# Altium project solar-powered-remote-water-level-relay.PrjPcb
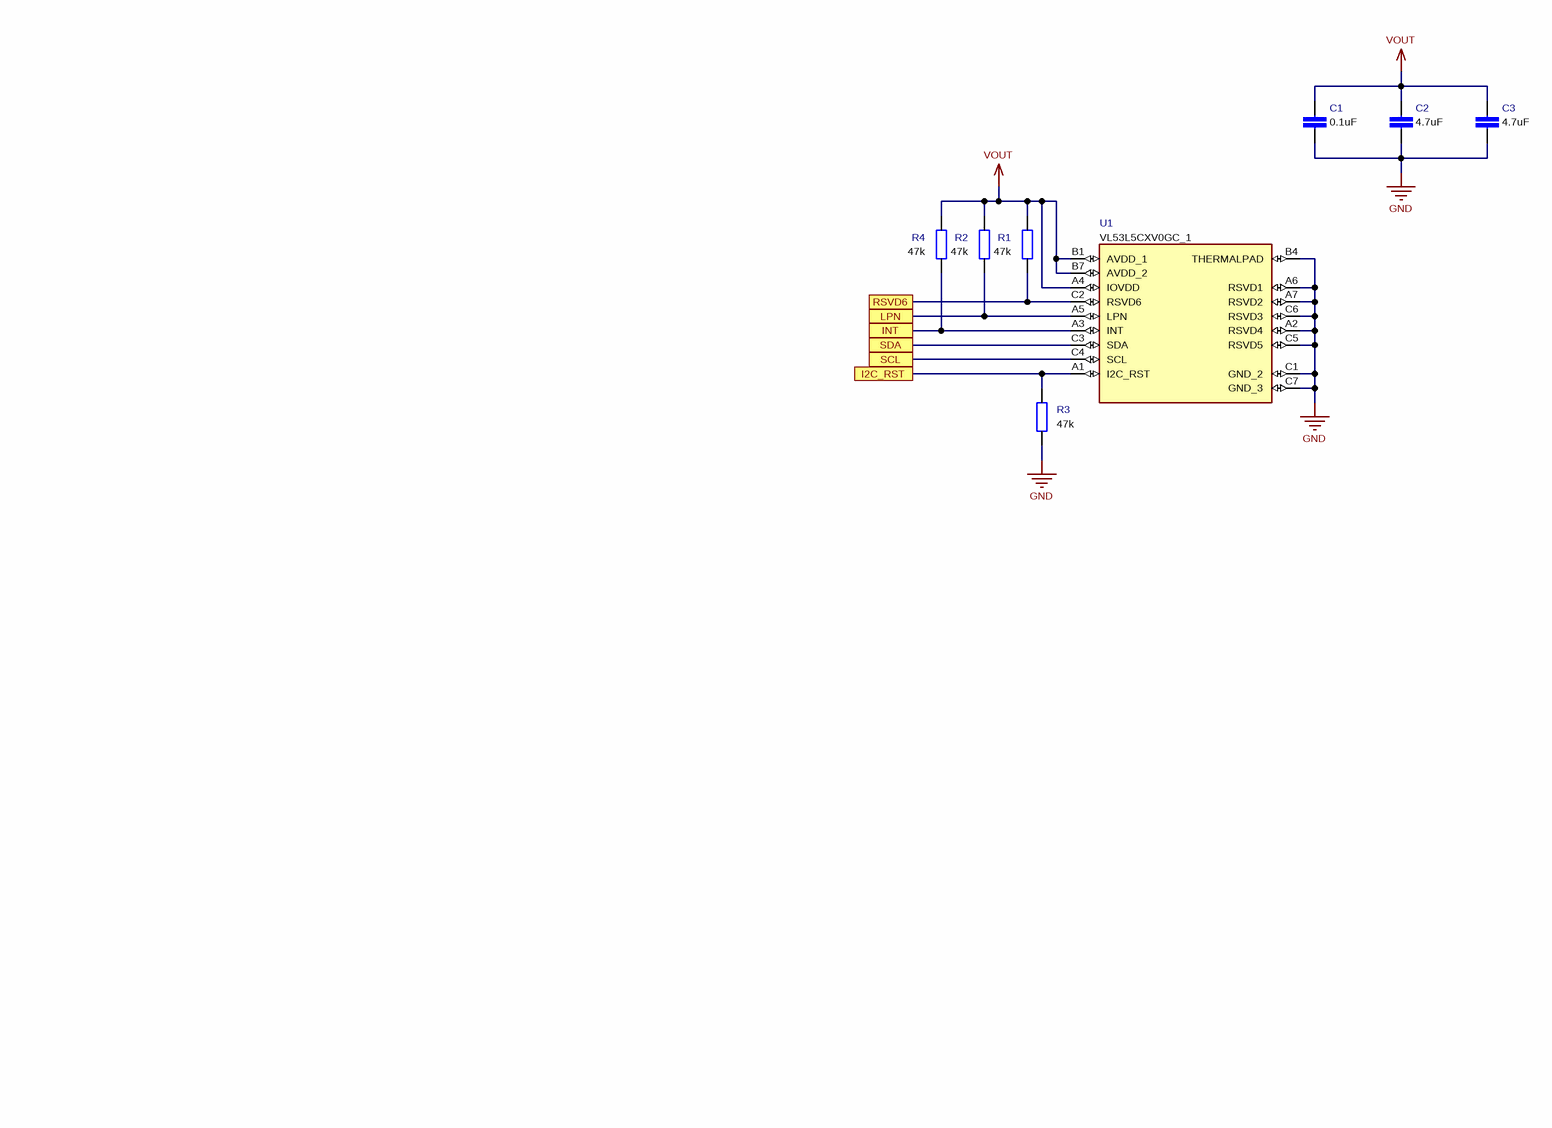
[diagram p0: Sheet1.SchDoc]
11 sheets, 50 parts. Net scope: global (net labels, ports and power ports of the same name join across sheets).
Board file: solar-powered-remote-water-level-relay.PcbDoc
Sheets:
  Sheet1.SchDoc
  Sheet2.SchDoc
  Sheet3.SchDoc
  Sheet4.SchDoc
  Sheet5.SchDoc
  Sheet6.SchDoc
  Sheet7.SchDoc
  Sheet8.SchDoc
  Sheet9.SchDoc
  Sheet10.SchDoc
  Sheet11.SchDoc

## Sheet Sheet1.SchDoc: solar-powered-remote-water-level-relay
size 419 x 297 mm; Date: 2026/06/29; Author: forlook88@gmail.com; Revision: 0; SheetNumber: 1; SheetTotal: 11

### Parts
C1  value 0.1uF
C2  value 4.7uF
C3  value 4.7uF
R1  value 47k
R2  value 47k
R3  value 47k
R4  value 47k
U1  value VL53L5CXV0GC_1

### Ports
I2C_RST, INT, LPN, RSVD6, SCL, SDA

### Nets
GND: C1.2 C2.2 C3.2 R3.1 U1.A2(RSVD4) U1.A6(RSVD1) U1.A7(RSVD2) U1.B4(THERMALPAD) U1.C1(GND_2) U1.C5(RSVD5) U1.C6(RSVD3) U1.C7(GND_3)
VOUT: C1.1 C2.1 C3.1 R1.1 R2.1 R4.1 U1.A4(IOVDD) U1.B1(AVDD_1) U1.B7(AVDD_2)
I2C_RST: R3.2 U1.A1(I2C_RST) ; port I2C_RST
INT: R4.2 U1.A3(INT) ; port INT
LPN: R2.2 U1.A5(LPN) ; port LPN
RSVD6: R1.2 U1.C2(RSVD6) ; port RSVD6
SCL: U1.C4(SCL) ; port SCL
SDA: U1.C3(SDA) ; port SDA

### Notes on the sheet
- Document Name:
- Project Name:
- Sheet Name:
- Sheet Number:
- Author:
- CELUS Design Platform electronic designs are machine-generated drafts and require verification by qualified specialists.
- of
- Revision:
- Date:
- By using these designs, you agree to the CELUS Terms of Use: https://www.celus.io/terms-of-use

### Library data of the parts
C1 = (no symbol name): Manufacturer Part Number: 0402ZD104KAT2A; Manufacturer: KYOCERA AVX
C2 C3 = (no symbol name): Manufacturer Part Number: GRM188R61E475KE11D; Manufacturer: Murata
R1-R4 = (no symbol name): Manufacturer Part Number: CRCW060347K0FKEA; Manufacturer: Vishay
U1 = (no symbol name): Manufacturer: STMicroelectronics; Manufacturer Part Number: VL53L5CXV0GC_1

## Sheet Sheet2.SchDoc: solar-powered-remote-water-level-relay
size 419 x 297 mm; Date: 2026/06/29; Author: forlook88@gmail.com; Revision: 0; SheetNumber: 2; SheetTotal: 11
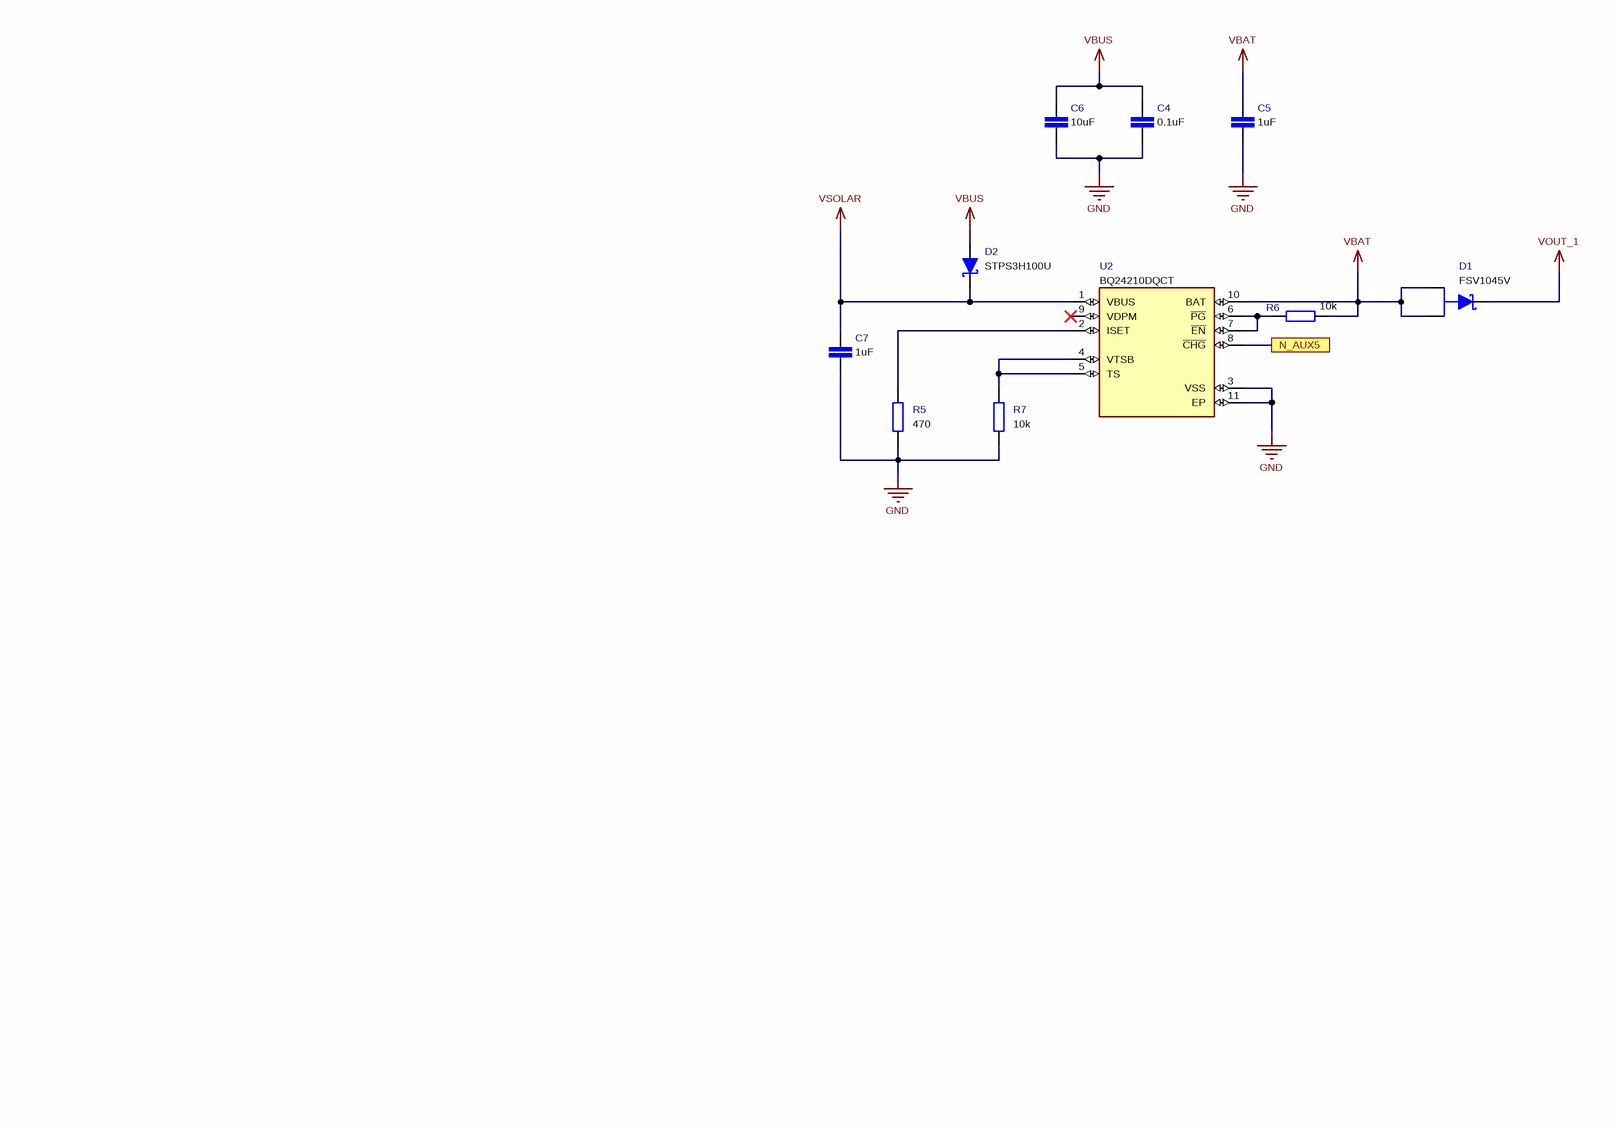
[diagram p1: Sheet2.SchDoc]

### Parts
C4  value 0.1uF
C5  value 1uF
C6  value 10uF
C7  value 1uF
D1  value FSV1045V
D2  value STPS3H100U
R5  value 470
R6  value 10k
R7  value 10k
U2  value BQ24210DQCT

### Ports
N_AUX5

### Nets
GND: C4.2 C5.2 C6.2 C7.2 R5.1 R7.1 U2.3(VSS) U2.11(EP)
VBAT: C5.1 D1.1(A) D1.2(A1) R6.1 U2.10(BAT)
VBUS: C4.1 C6.1 D2.1(A)
VOUT_1: D1.3(K)
VSOLAR: C7.1 D2.2(K) U2.1(VBUS)
N_AUX5: U2.8(~{CHG}) ; port N_AUX5
NetR5_2: R5.2 U2.2(ISET)
NetR6_2: R6.2 U2.6(~{PG}) U2.7(~{EN})
NetR7_2: R7.2 U2.4(VTSB) U2.5(TS)

Not connected (* = marked no-connect by the designer): U2 9(VDPM)*

### Notes on the sheet
- Document Name:
- Project Name:
- Sheet Name:
- Sheet Number:
- Author:
- CELUS Design Platform electronic designs are machine-generated drafts and require verification by qualified specialists.
- of
- Revision:
- Date:
- By using these designs, you agree to the CELUS Terms of Use: https://www.celus.io/terms-of-use

### Library data of the parts
C4 = (no symbol name): Manufacturer Part Number: CL05B104KO5NNNC; Manufacturer: Samsung
C5 C7 = (no symbol name): Manufacturer Part Number: CL05A105KO5NNNC; Manufacturer: Samsung Electro-Mechanics
C6 = (no symbol name): Manufacturer Part Number: CL31A106KAHNNNE; Manufacturer: Samsung
D1 = (no symbol name): Manufacturer: onsemi; Manufacturer Part Number: FSV1045V
D2 = (no symbol name): Manufacturer: STMicroelectronics; Manufacturer Part Number: STPS3H100U
R5 = (no symbol name): Manufacturer Part Number: RC0402FR-07470RL; Manufacturer: YAGEO
R6 R7 = (no symbol name): Manufacturer Part Number: RC1005F103CS; Manufacturer: Samsung
U2 = (no symbol name): Manufacturer: Texas Instruments; Manufacturer Part Number: BQ24210DQCT

## Sheet Sheet3.SchDoc: solar-powered-remote-water-level-relay
size 419 x 297 mm; Date: 2026/06/29; Author: forlook88@gmail.com; Revision: 0; SheetNumber: 3; SheetTotal: 11
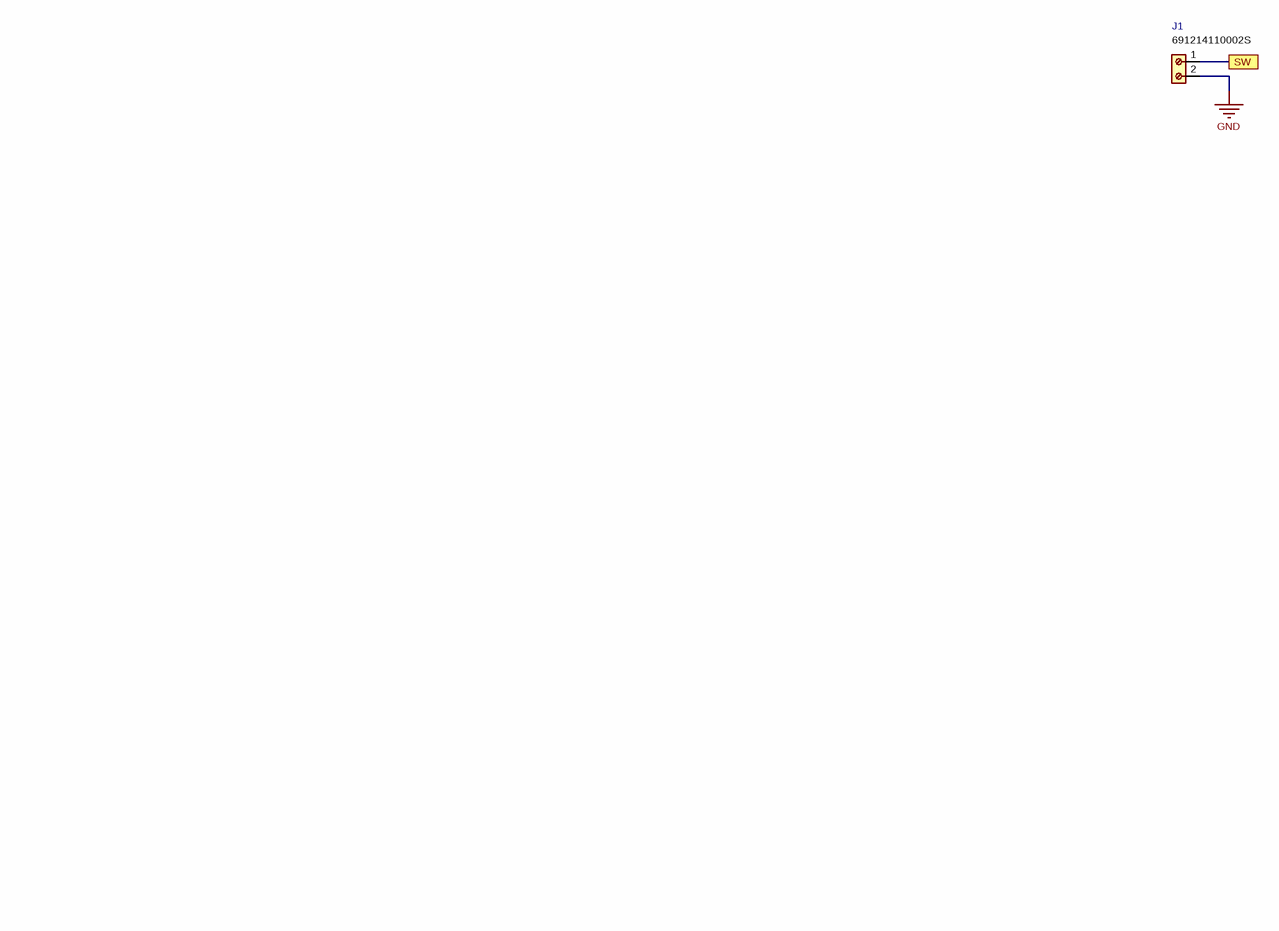
[diagram p2: Sheet3.SchDoc]

### Parts
J1  value 691214110002S

### Ports
SW

### Nets
GND: J1.2
SW: J1.1 ; port SW

### Notes on the sheet
- Document Name:
- Project Name:
- Sheet Name:
- Sheet Number:
- Author:
- CELUS Design Platform electronic designs are machine-generated drafts and require verification by qualified specialists.
- of
- Revision:
- Date:
- By using these designs, you agree to the CELUS Terms of Use: https://www.celus.io/terms-of-use

### Library data of the parts
J1 = (no symbol name): Manufacturer: Würth Elektronik; Manufacturer Part Number: 691214110002S

## Sheet Sheet4.SchDoc: solar-powered-remote-water-level-relay
size 419 x 297 mm; Date: 2026/06/29; Author: forlook88@gmail.com; Revision: 0; SheetNumber: 4; SheetTotal: 11
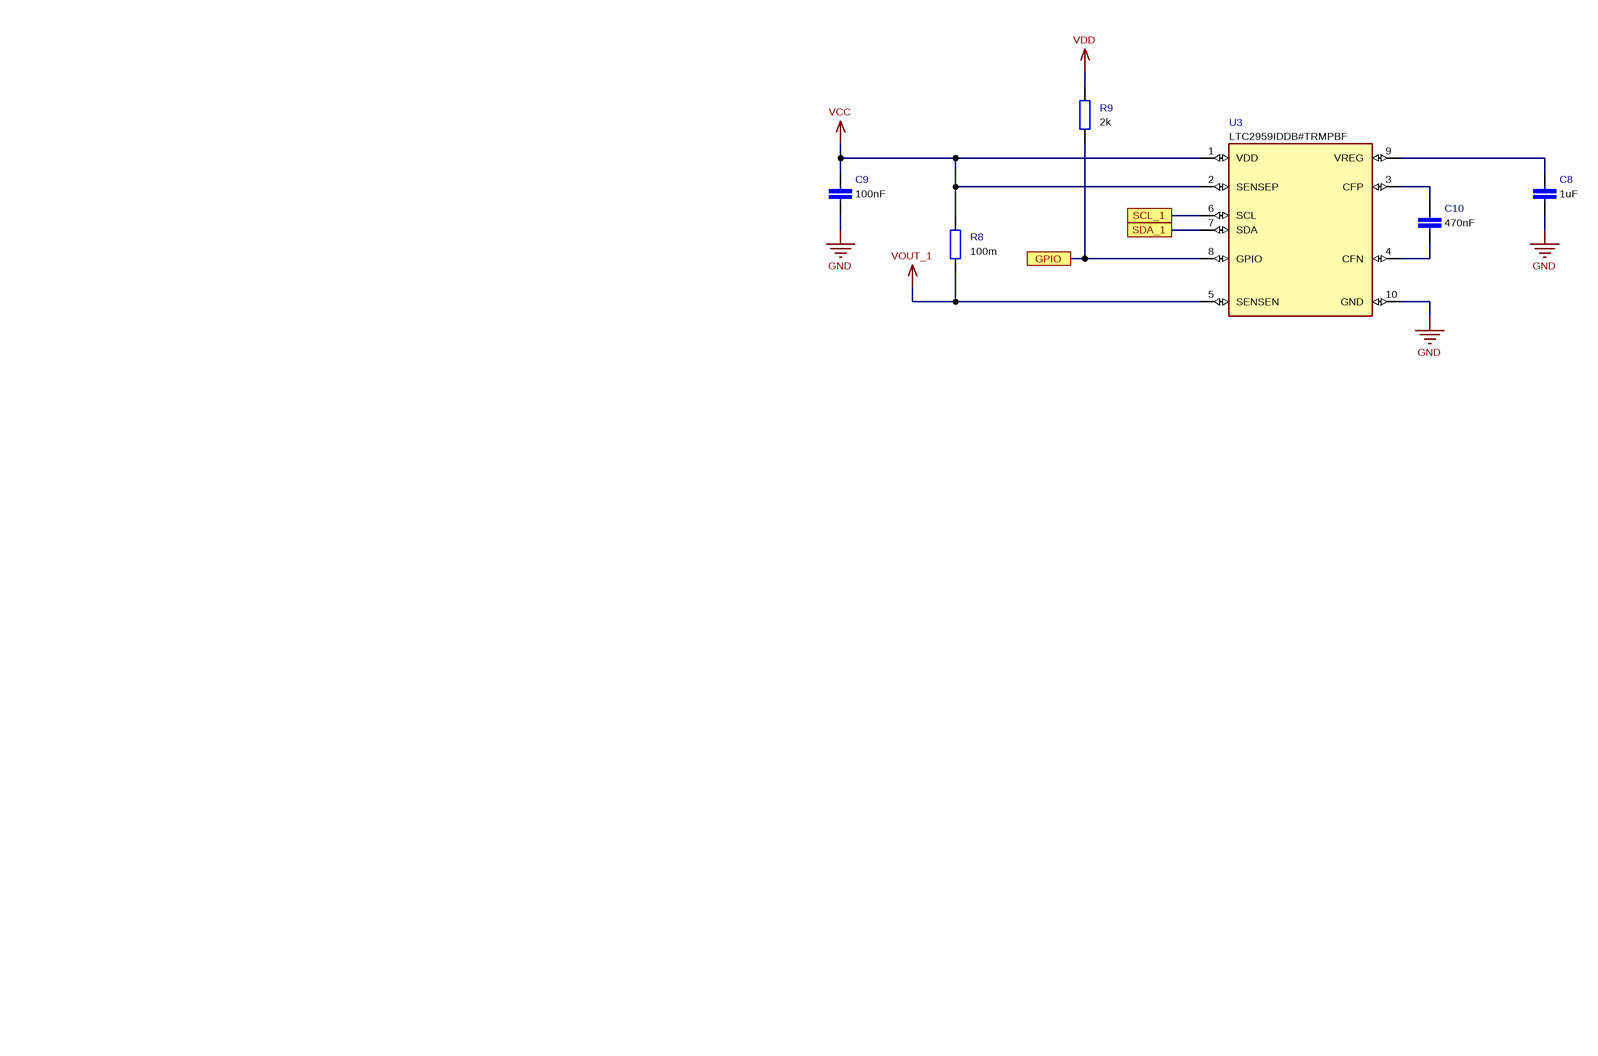
[diagram p3: Sheet4.SchDoc]

### Parts
C8  value 1uF
C9  value 100nF
C10  value 470nF
R8  value 100m
R9  value 2k
U3  value LTC2959IDDB#TRMPBF

### Ports
GPIO, SCL_1, SDA_1

### Nets
GND: C8.2 C9.2 U3.10(GND) U3.11(GND)
VCC: C9.1 R8.2 U3.1(VDD) U3.2(SENSEP)
VDD: R9.2
VOUT_1: R8.1 U3.5(SENSEN)
GPIO: R9.1 U3.8(GPIO) ; port GPIO
SCL_1: U3.6(SCL) ; port SCL_1
SDA_1: U3.7(SDA) ; port SDA_1
NetC8_1: C8.1 U3.9(VREG)
NetC10_1: C10.1 U3.3(CFP)
NetC10_2: C10.2 U3.4(CFN)

### Notes on the sheet
- Document Name:
- Project Name:
- Sheet Name:
- Sheet Number:
- Author:
- CELUS Design Platform electronic designs are machine-generated drafts and require verification by qualified specialists.
- of
- Revision:
- Date:
- By using these designs, you agree to the CELUS Terms of Use: https://www.celus.io/terms-of-use

### Library data of the parts
C8 = (no symbol name): Manufacturer Part Number: 12061C105K4Z4A; Manufacturer: KYOCERA AVX
C9 = (no symbol name): Manufacturer Part Number: 08051C104KAT2A; Manufacturer: KYOCERA AVX
C10 = (no symbol name): Manufacturer Part Number: 08051C474K4Z2A; Manufacturer: KYOCERA AVX
R8 = (no symbol name): Manufacturer Part Number: ERJ-2BSFR10X; Manufacturer: Panasonic
R9 = (no symbol name): Manufacturer Part Number: ERJ-2RKF2001X; Manufacturer: Panasonic
U3 = (no symbol name): Manufacturer: Analog Devices; Manufacturer Part Number: LTC2959IDDB#TRMPBF

## Sheet Sheet5.SchDoc: solar-powered-remote-water-level-relay
size 419 x 297 mm; Date: 2026/06/29; Author: forlook88@gmail.com; Revision: 0; SheetNumber: 5; SheetTotal: 11
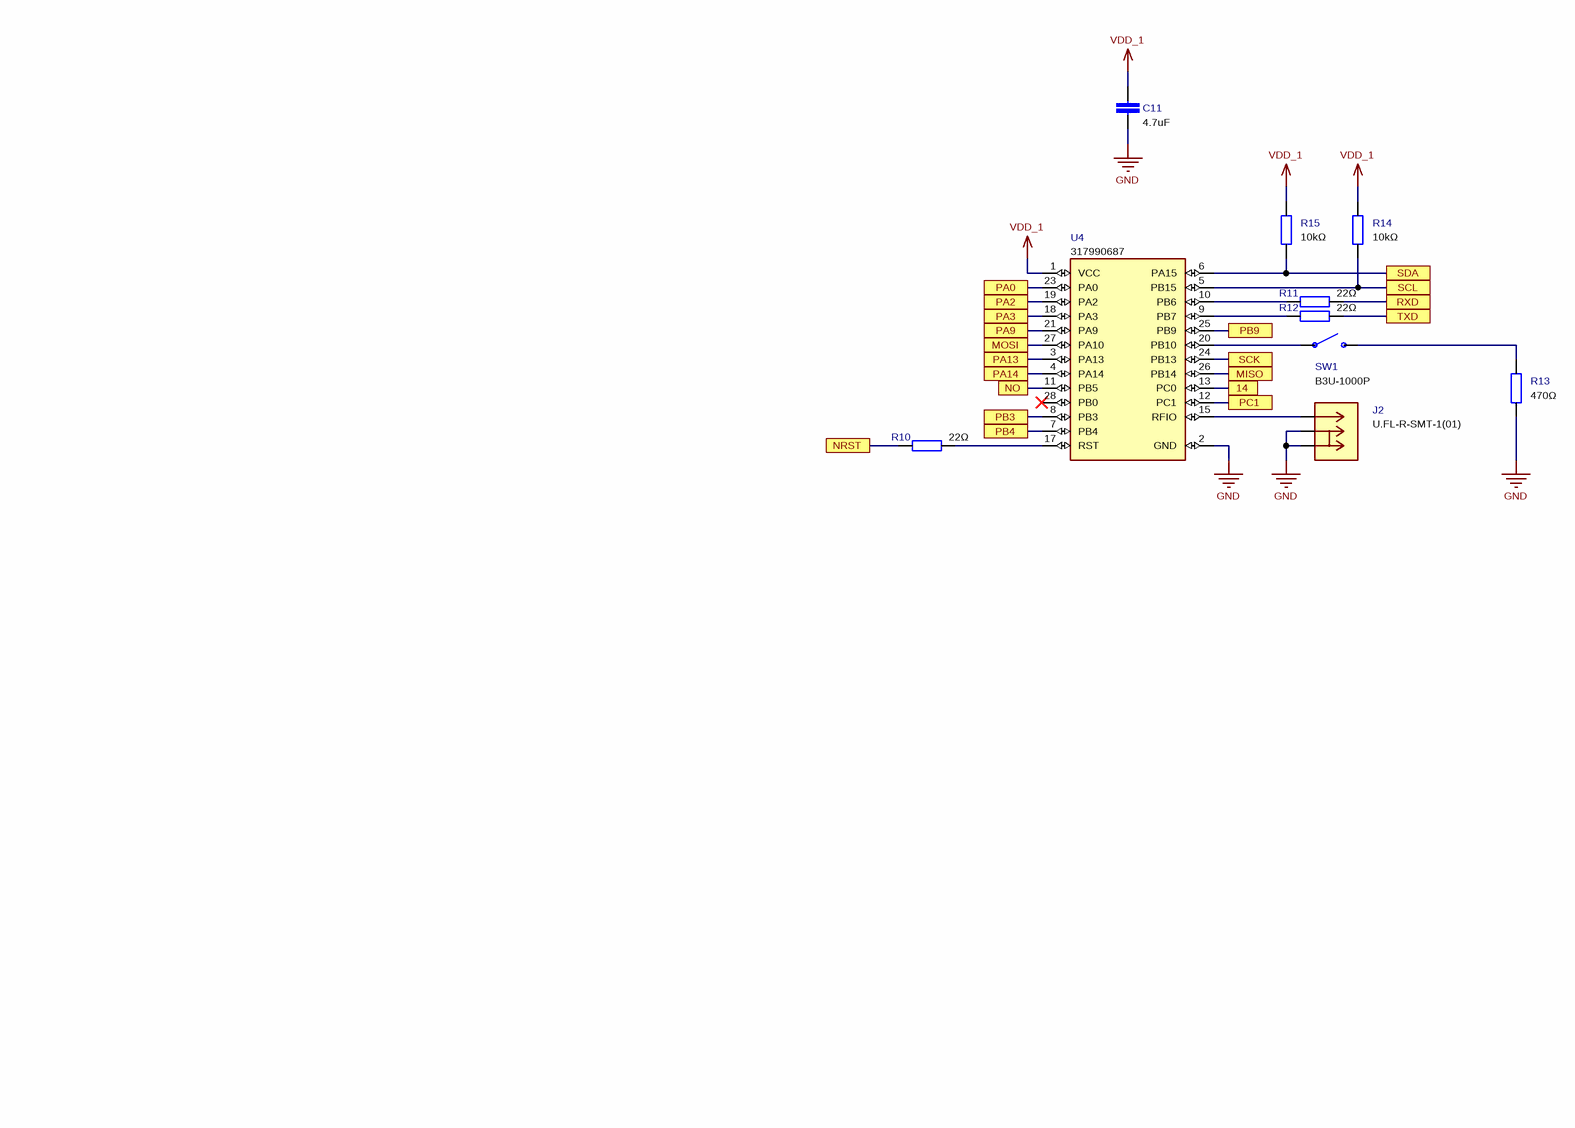
[diagram p4: Sheet5.SchDoc]

### Parts
C11  value 4.7uF
J2  value U.FL-R-SMT-1(01)
R10  value 22Ω
R11  value 22Ω
R12  value 22Ω
R13  value 470Ω
R14  value 10kΩ
R15  value 10kΩ
SW1  value B3U-1000P
U4  value 317990687

### Ports
14, MISO, MOSI, NO, NRST, PA0, PA2, PA3, PA9, PA13, PA14, PB3, PB4, PB9, PC1, RXD, SCK, SCL, SDA, TXD

### Nets
GND: C11.2 J2.2(GND_2) J2.3(GND) R13.1 U4.2(GND) U4.14(GND) U4.16(GND) U4.22(GND)
VDD_1: C11.1 R14.2 R15.2 U4.1(VCC)
14: U4.13(PC0) ; port 14
MISO: U4.26(PB14) ; port MISO
MOSI: U4.27(PA10) ; port MOSI
NO: U4.11(PB5) ; port NO
NRST: R10.2 ; port NRST
PA0: U4.23(PA0) ; port PA0
PA2: U4.19(PA2) ; port PA2
PA3: U4.18(PA3) ; port PA3
PA9: U4.21(PA9) ; port PA9
PA13: U4.3(PA13) ; port PA13
PA14: U4.4(PA14) ; port PA14
PB3: U4.8(PB3) ; port PB3
PB4: U4.7(PB4) ; port PB4
PB9: U4.25(PB9) ; port PB9
PC1: U4.12(PC1) ; port PC1
RXD: R11.1 ; port RXD
SCK: U4.24(PB13) ; port SCK
SCL: R14.1 U4.5(PB15) ; port SCL
SDA: R15.1 U4.6(PA15) ; port SDA
TXD: R12.1 ; port TXD
NetJ2_1: J2.1(SIGNAL) U4.15(RFIO)
NetR10_1: R10.1 U4.17(RST)
NetR11_2: R11.2 U4.10(PB6)
NetR12_2: R12.2 U4.9(PB7)
NetR13_2: R13.2 SW1.2(P$2)
NetSW1_1: SW1.1(P$1) U4.20(PB10)

Not connected (* = marked no-connect by the designer): U4 28(PB0)*

### Notes on the sheet
- Document Name:
- Project Name:
- Sheet Name:
- Sheet Number:
- Author:
- CELUS Design Platform electronic designs are machine-generated drafts and require verification by qualified specialists.
- of
- Revision:
- Date:
- By using these designs, you agree to the CELUS Terms of Use: https://www.celus.io/terms-of-use

### Library data of the parts
C11 = (no symbol name): Manufacturer Part Number: CM05X5R475M25AH; Manufacturer: KYOCERA
J2 = (no symbol name): Manufacturer: HIROSE; Manufacturer Part Number: U.FL-R-SMT-1(01)
R10-R12 = (no symbol name): Manufacturer Part Number: ERJ-2RKF22R0X; Manufacturer: PANASONIC
R13 = (no symbol name): Manufacturer Part Number: AC0402FR-7W470RL; Manufacturer: YAGEO
R14 R15 = (no symbol name): Manufacturer Part Number: SG73P1EWTTP1002F; Manufacturer: KOA SPEER
SW1 = (no symbol name): Manufacturer: Omron; Manufacturer Part Number: B3U-1000P
U4 = (no symbol name): Manufacturer: Seeed Studio; Manufacturer Part Number: 317990687

## Sheet Sheet6.SchDoc: solar-powered-remote-water-level-relay
size 419 x 297 mm; Date: 2026/06/29; Author: forlook88@gmail.com; Revision: 0; SheetNumber: 6; SheetTotal: 11
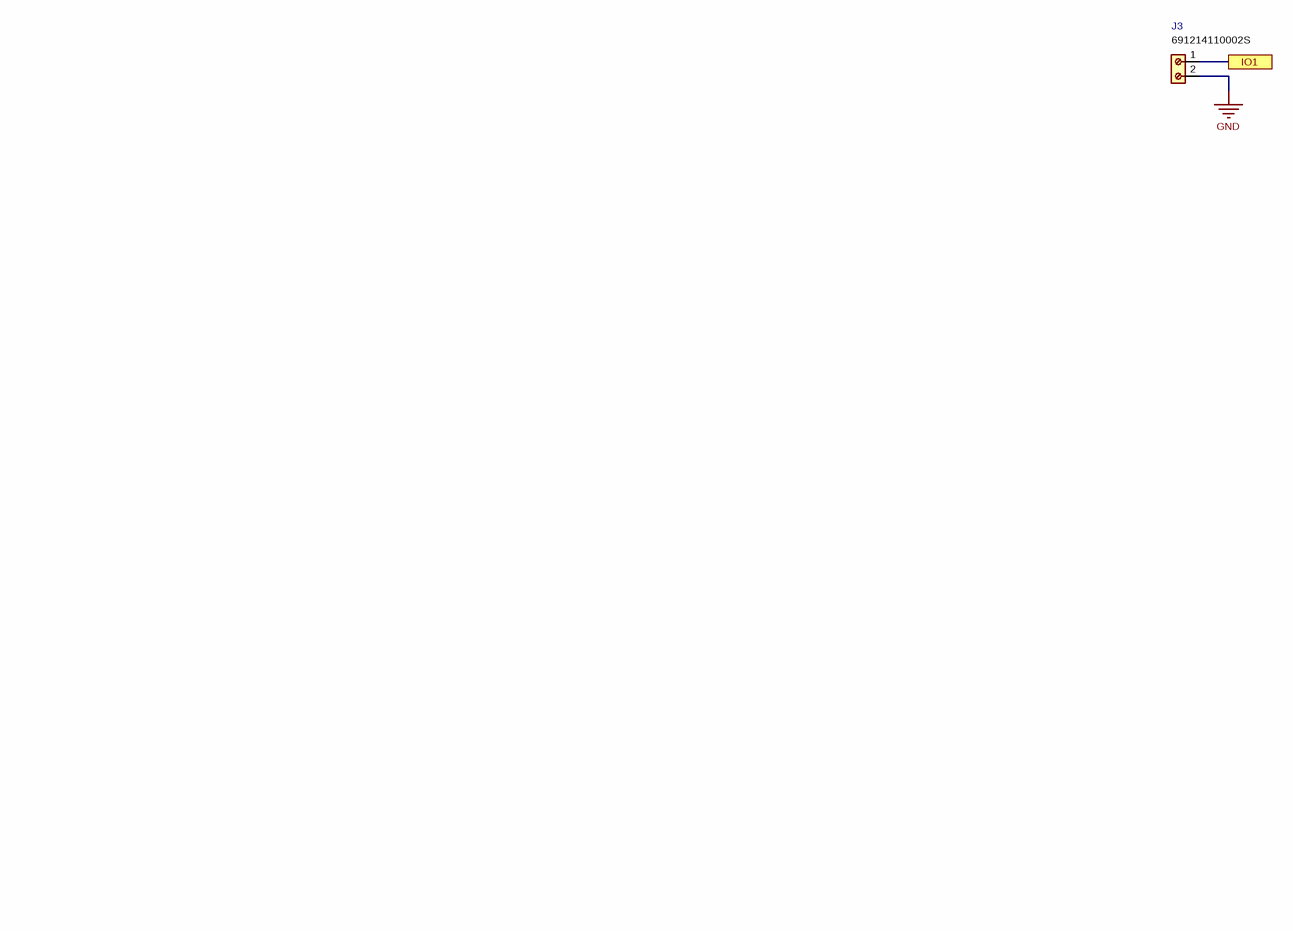
[diagram p5: Sheet6.SchDoc]

### Parts
J3  value 691214110002S

### Ports
IO1

### Nets
GND: J3.2
IO1: J3.1 ; port IO1

### Notes on the sheet
- Document Name:
- Project Name:
- Sheet Name:
- Sheet Number:
- Author:
- CELUS Design Platform electronic designs are machine-generated drafts and require verification by qualified specialists.
- of
- Revision:
- Date:
- By using these designs, you agree to the CELUS Terms of Use: https://www.celus.io/terms-of-use

### Library data of the parts
J3 = (no symbol name): Manufacturer: Würth Elektronik; Manufacturer Part Number: 691214110002S

## Sheet Sheet7.SchDoc: solar-powered-remote-water-level-relay
size 419 x 297 mm; Date: 2026/06/29; Author: forlook88@gmail.com; Revision: 0; SheetNumber: 7; SheetTotal: 11
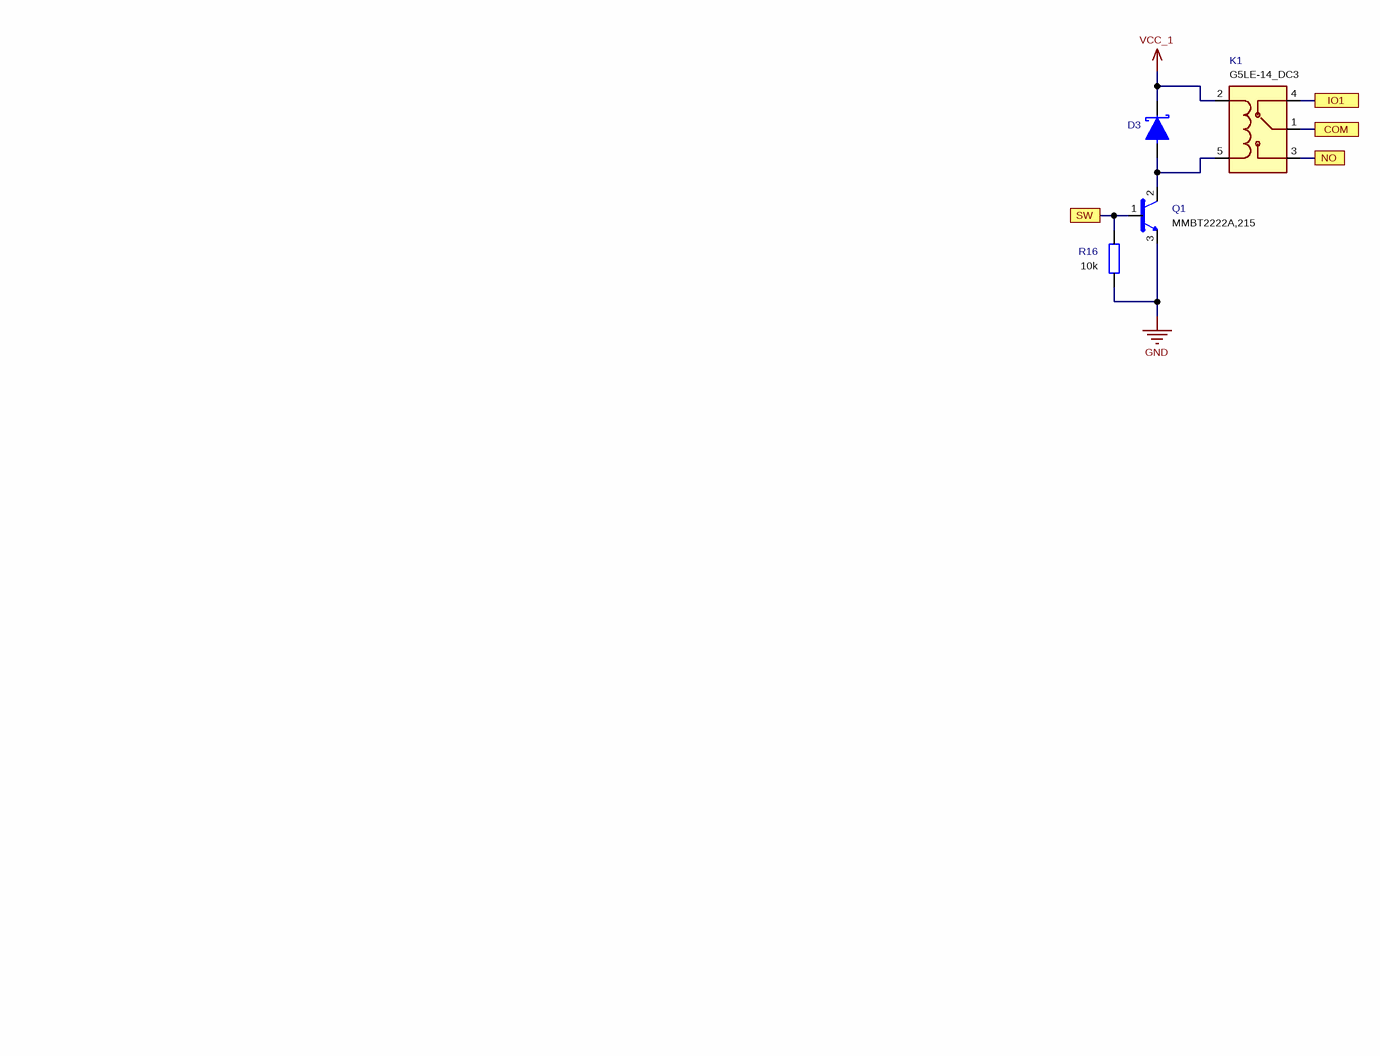
[diagram p6: Sheet7.SchDoc]

### Parts
D3  (no value)
K1  value G5LE-14_DC3
Q1  value MMBT2222A,215
R16  value 10k

### Ports
COM, IO1, NO, SW

### Nets
GND: Q1.3(EMITTER) R16.1
VCC_1: D3.K K1.2(COIL1)
COM: K1.1(COM) ; port COM
IO1: K1.4(NC) ; port IO1
NO: K1.3(NO) ; port NO
SW: Q1.1(BASE) R16.2 ; port SW
NetD3_A: D3.A K1.5(COIL2) Q1.2(COLLECTOR)

### Notes on the sheet
- Document Name:
- Project Name:
- Sheet Name:
- Sheet Number:
- Author:
- CELUS Design Platform electronic designs are machine-generated drafts and require verification by qualified specialists.
- of
- Revision:
- Date:
- By using these designs, you agree to the CELUS Terms of Use: https://www.celus.io/terms-of-use

### Library data of the parts
D3 = (no symbol name): Manufacturer Part Number: MBR140SFT1G; Manufacturer: OnSemi
K1 = (no symbol name): Manufacturer: Omron Electronics; Manufacturer Part Number: G5LE-14_DC3
Q1 = (no symbol name): Manufacturer: Nexperia; Manufacturer Part Number: MMBT2222A,215
R16 = (no symbol name): Manufacturer Part Number: ERJ-2GEJ103X; Manufacturer: Panasonic

## Sheet Sheet8.SchDoc: solar-powered-remote-water-level-relay
size 419 x 297 mm; Date: 2026/06/29; Author: forlook88@gmail.com; Revision: 0; SheetNumber: 8; SheetTotal: 11
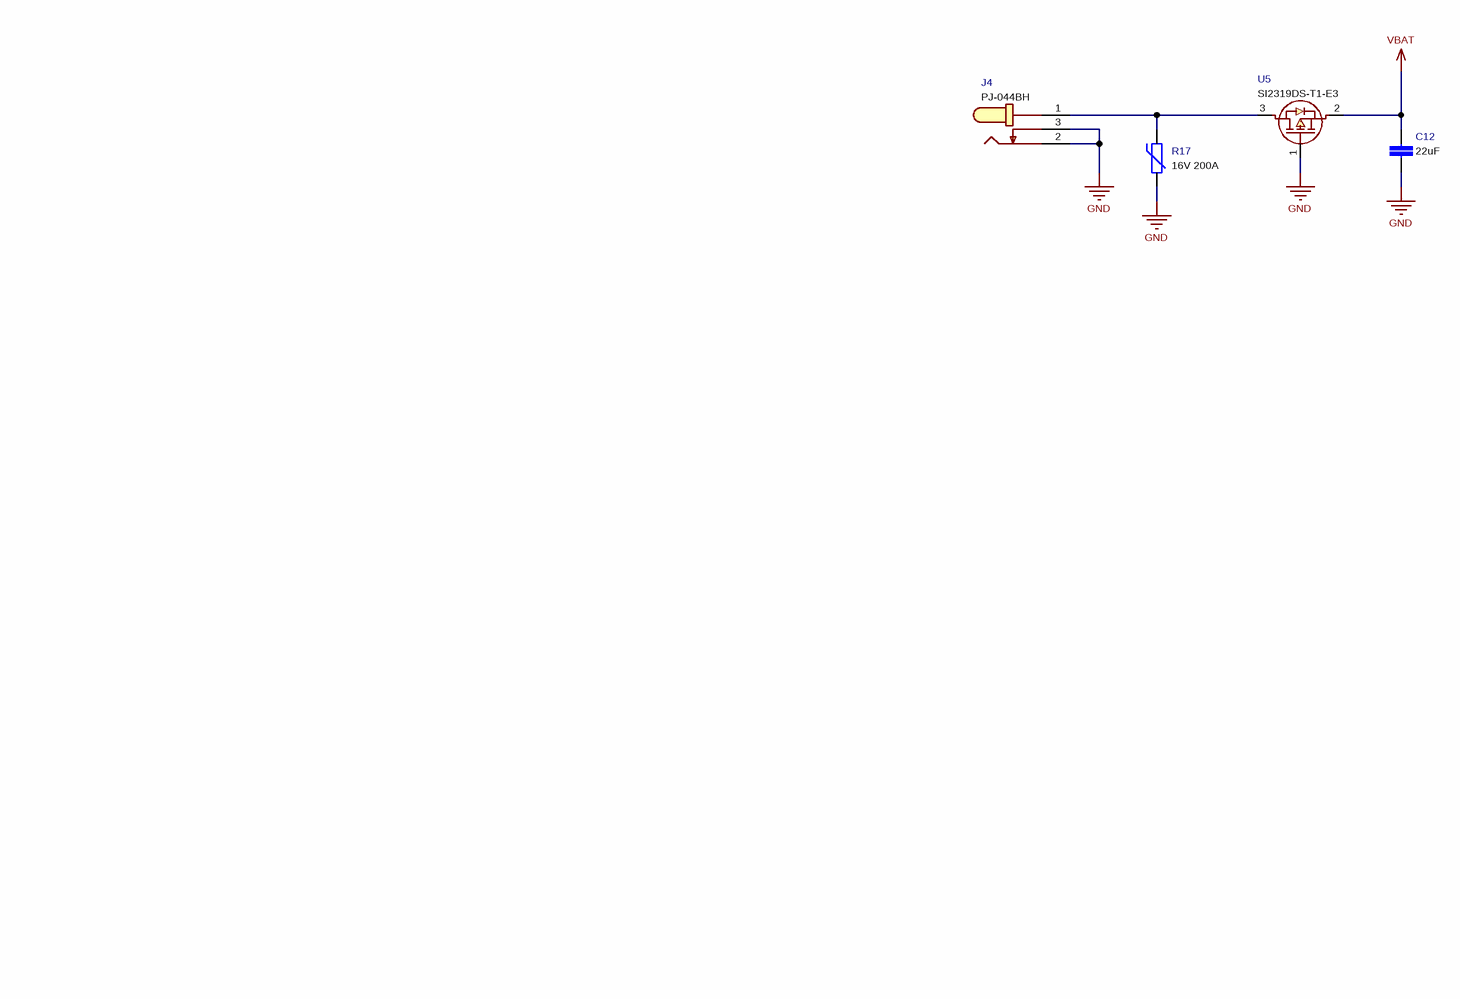
[diagram p7: Sheet8.SchDoc]

### Parts
C12  value 22uF
J4  value PJ-044BH
R17  value 16V 200A
U5  value SI2319DS-T1-E3

### Nets
GND: C12.2 J4.2 J4.3 R17.1 U5.1(G)
VBAT: C12.1 U5.2(S)
NetJ4_1: J4.1 R17.2 U5.3(D)

### Notes on the sheet
- Document Name:
- Project Name:
- Sheet Name:
- Sheet Number:
- Author:
- CELUS Design Platform electronic designs are machine-generated drafts and require verification by qualified specialists.
- of
- Revision:
- Date:
- By using these designs, you agree to the CELUS Terms of Use: https://www.celus.io/terms-of-use

### Library data of the parts
C12 = (no symbol name): Manufacturer Part Number: GRT21BR61E226ME13L; Manufacturer: Murata
J4 = (no symbol name): Manufacturer: CUI Devices; Manufacturer Part Number: PJ-044BH
R17 = (no symbol name): Manufacturer Part Number: 0805SA240-1R5J; Manufacturer: SFI Electronics
U5 = (no symbol name): Manufacturer: Vishay; Manufacturer Part Number: SI2319DS-T1-E3

## Sheet Sheet9.SchDoc: solar-powered-remote-water-level-relay
size 419 x 297 mm; Date: 2026/06/29; Author: forlook88@gmail.com; Revision: 0; SheetNumber: 9; SheetTotal: 11
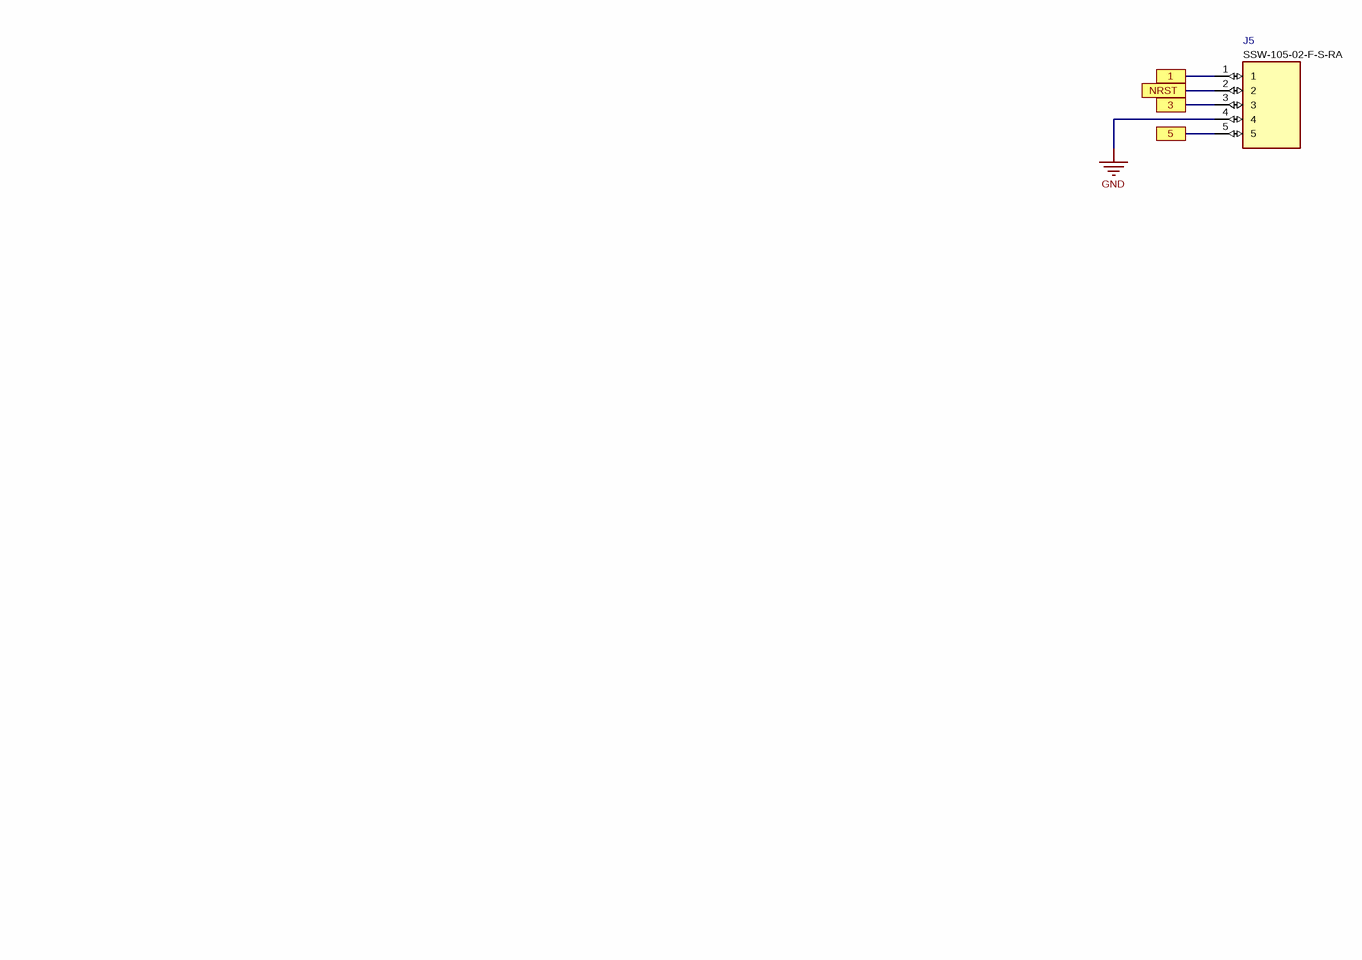
[diagram p8: Sheet9.SchDoc]

### Parts
J5  value SSW-105-02-F-S-RA

### Ports
1, 3, 5, NRST

### Nets
GND: J5.4
1: J5.1 ; port 1
3: J5.3 ; port 3
5: J5.5 ; port 5
NRST: J5.2 ; port NRST

### Notes on the sheet
- Document Name:
- Project Name:
- Sheet Name:
- Sheet Number:
- Author:
- CELUS Design Platform electronic designs are machine-generated drafts and require verification by qualified specialists.
- of
- Revision:
- Date:
- By using these designs, you agree to the CELUS Terms of Use: https://www.celus.io/terms-of-use

### Library data of the parts
J5 = (no symbol name): Manufacturer: SAMTEC; Manufacturer Part Number: SSW-105-02-F-S-RA

## Sheet Sheet10.SchDoc: solar-powered-remote-water-level-relay
size 419 x 297 mm; Date: 2026/06/29; Author: forlook88@gmail.com; Revision: 0; SheetNumber: 10; SheetTotal: 11
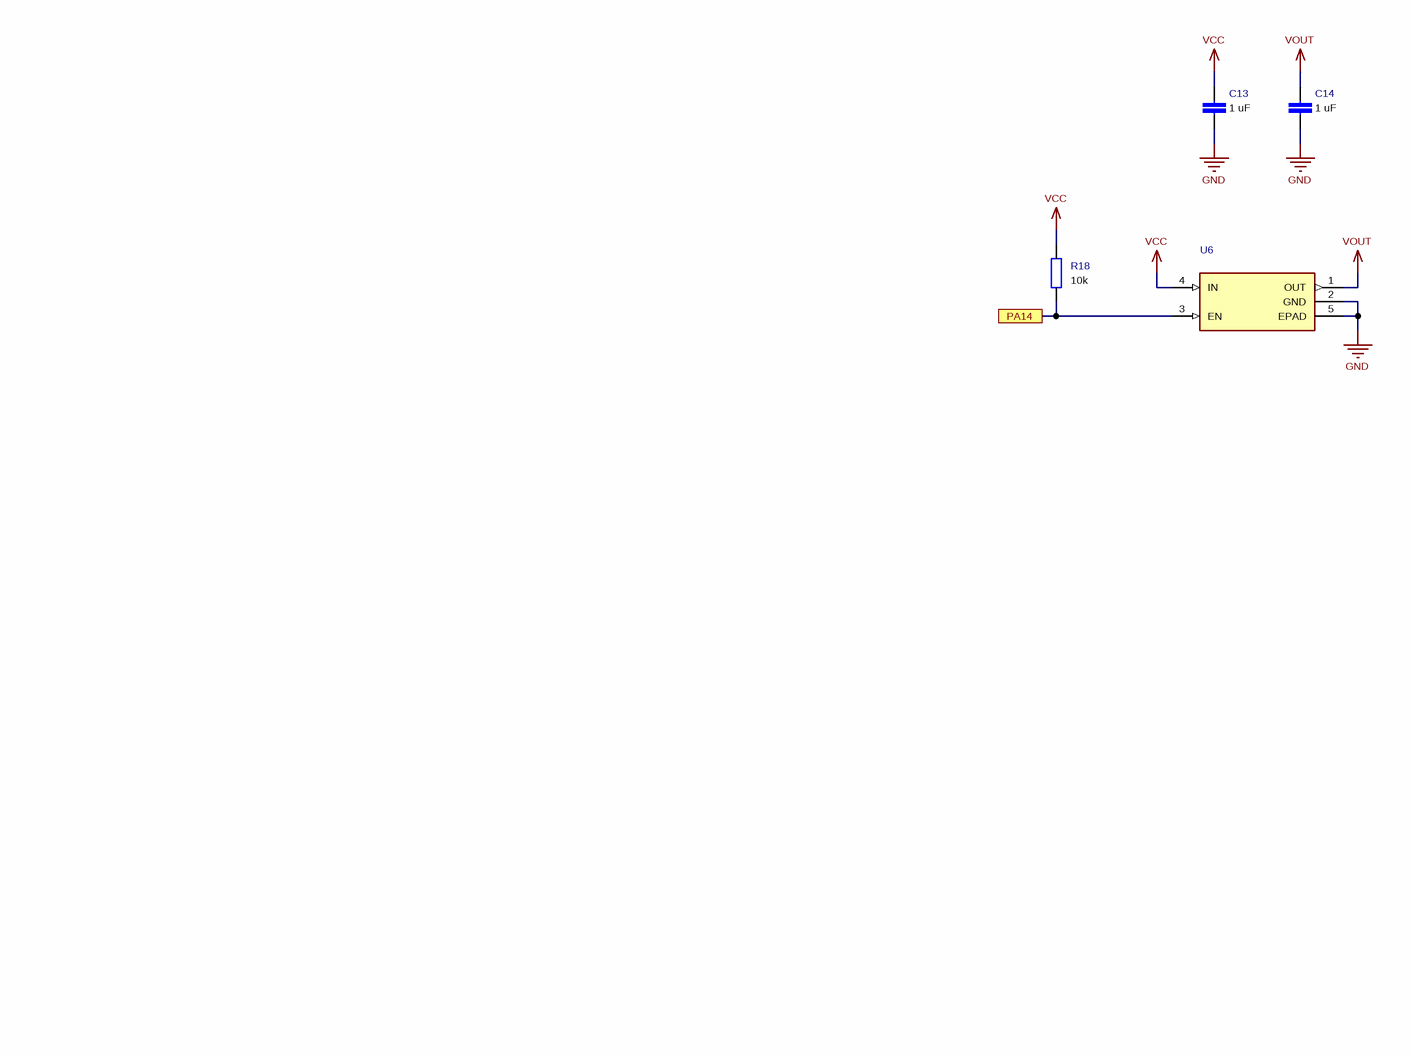
[diagram p9: Sheet10.SchDoc]

### Parts
C13  value 1 uF
C14  value 1 uF
R18  value 10k
U6  (no value)

### Ports
PA14

### Nets
GND: C13.2 C14.2 U6.2(GND) U6.5(EPAD)
VCC: C13.1 R18.2 U6.4(IN)
VOUT: C14.1 U6.1(OUT)
PA14: R18.1 U6.3(EN) ; port PA14

### Notes on the sheet
- Document Name:
- Project Name:
- Sheet Name:
- Sheet Number:
- Author:
- CELUS Design Platform electronic designs are machine-generated drafts and require verification by qualified specialists.
- of
- Revision:
- Date:
- By using these designs, you agree to the CELUS Terms of Use: https://www.celus.io/terms-of-use

### Library data of the parts
C13 C14 = (no symbol name): Manufacturer Part Number: CL05A105KP5NNWC; Manufacturer: Samsung Electro-Mechanics
R18 = (no symbol name): as R16 on sheet Sheet7
U6 = (no symbol name): Manufacturer Part Number: NCP114AMX330TBG; Manufacturer: ON Semiconductor

## Sheet Sheet11.SchDoc: solar-powered-remote-water-level-relay
size 419 x 297 mm; Date: 2026/06/29; Author: forlook88@gmail.com; Revision: 0; SheetNumber: 11; SheetTotal: 11
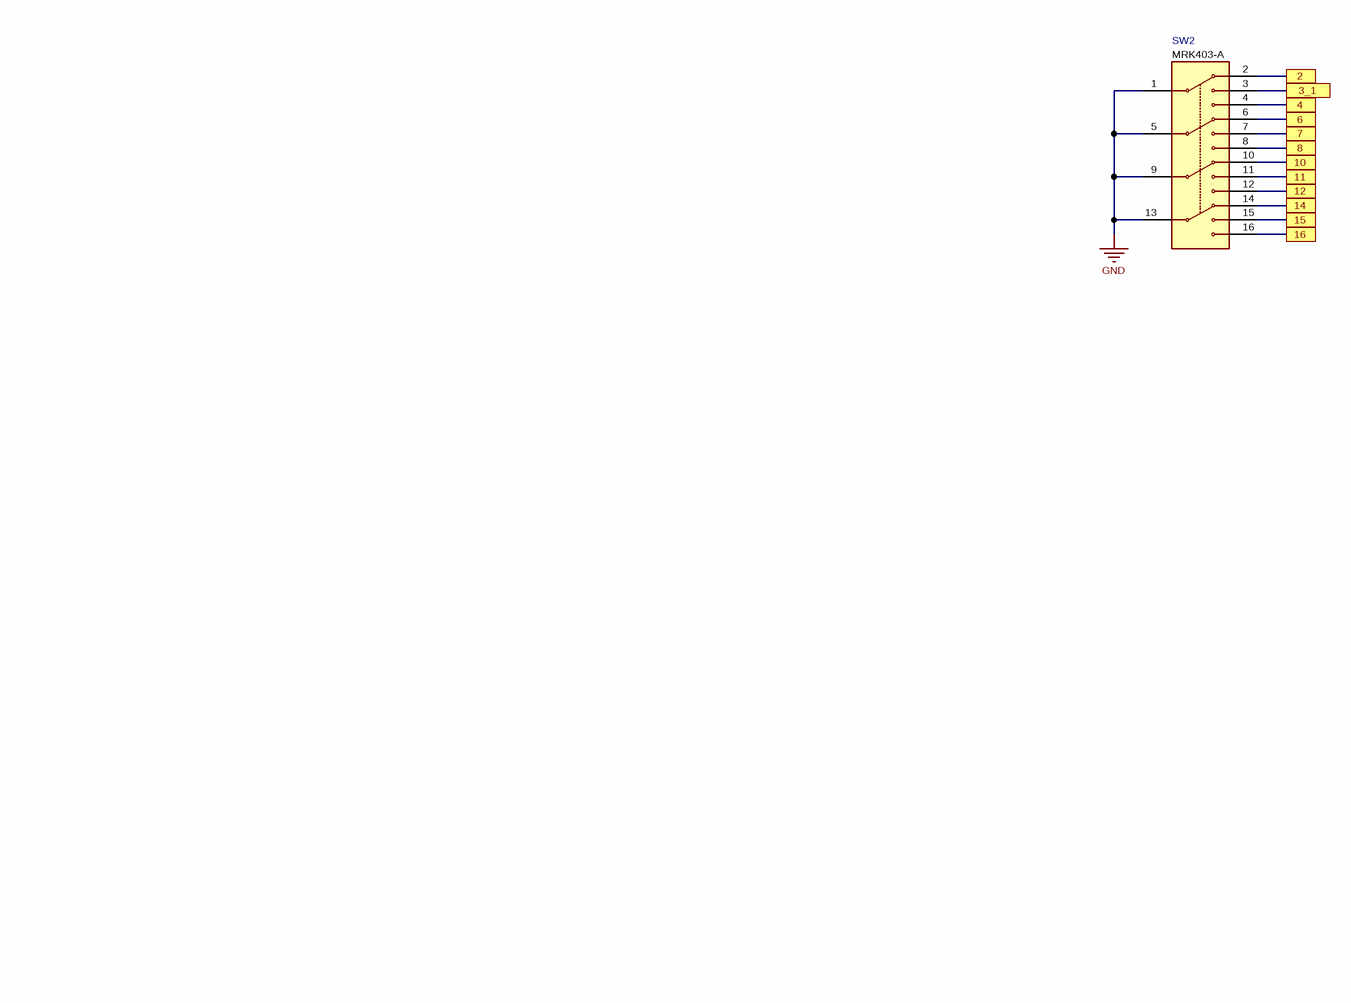
[diagram p10: Sheet11.SchDoc]

### Parts
SW2  value MRK403-A

### Ports
2, 3_1, 4, 6, 7, 8, 10, 11, 12, 14, 15, 16

### Nets
GND: SW2.1 SW2.5 SW2.9 SW2.13
2: SW2.2 ; port 2
3_1: SW2.3 ; port 3_1
4: SW2.4 ; port 4
6: SW2.6 ; port 6
7: SW2.7 ; port 7
8: SW2.8 ; port 8
10: SW2.10 ; port 10
11: SW2.11 ; port 11
12: SW2.12 ; port 12
14: SW2.14 ; port 14
15: SW2.15 ; port 15
16: SW2.16 ; port 16

### Notes on the sheet
- Document Name:
- Project Name:
- Sheet Name:
- Sheet Number:
- Author:
- CELUS Design Platform electronic designs are machine-generated drafts and require verification by qualified specialists.
- of
- Revision:
- Date:
- By using these designs, you agree to the CELUS Terms of Use: https://www.celus.io/terms-of-use

### Library data of the parts
SW2 = (no symbol name): Manufacturer: NKK Switches; Manufacturer Part Number: MRK403-A

## Nets that join several sheets
GND: Sheet1 (12 pins), Sheet2 (8 pins), Sheet3 (J1.2), Sheet4 (C8.2 C9.2 U3.10 U3.11), Sheet5 (8 pins), Sheet6 (J3.2), Sheet7 (Q1.3 R16.1), Sheet8 (5 pins), Sheet9 (J5.4), Sheet10 (C13.2 C14.2 U6.2 U6.5), Sheet11 (SW2.1 SW2.5 SW2.9 SW2.13)
VBAT: Sheet2 (5 pins), Sheet8 (C12.1 U5.2)
VCC: Sheet4 (C9.1 R8.2 U3.1 U3.2), Sheet10 (C13.1 R18.2 U6.4)
VOUT: Sheet1 (9 pins), Sheet10 (C14.1 U6.1)
VOUT_1: Sheet2 (D1.3), Sheet4 (R8.1 U3.5)
14: Sheet5 (U4.13), Sheet11 (SW2.14)
IO1: Sheet6 (J3.1), Sheet7 (K1.4)
NO: Sheet5 (U4.11), Sheet7 (K1.3)
NRST: Sheet5 (R10.2), Sheet9 (J5.2)
PA14: Sheet5 (U4.4), Sheet10 (R18.1 U6.3)
SCL: Sheet1 (U1.C4), Sheet5 (R14.1 U4.5)
SDA: Sheet1 (U1.C3), Sheet5 (R15.1 U4.6)
SW: Sheet3 (J1.1), Sheet7 (Q1.1 R16.2)